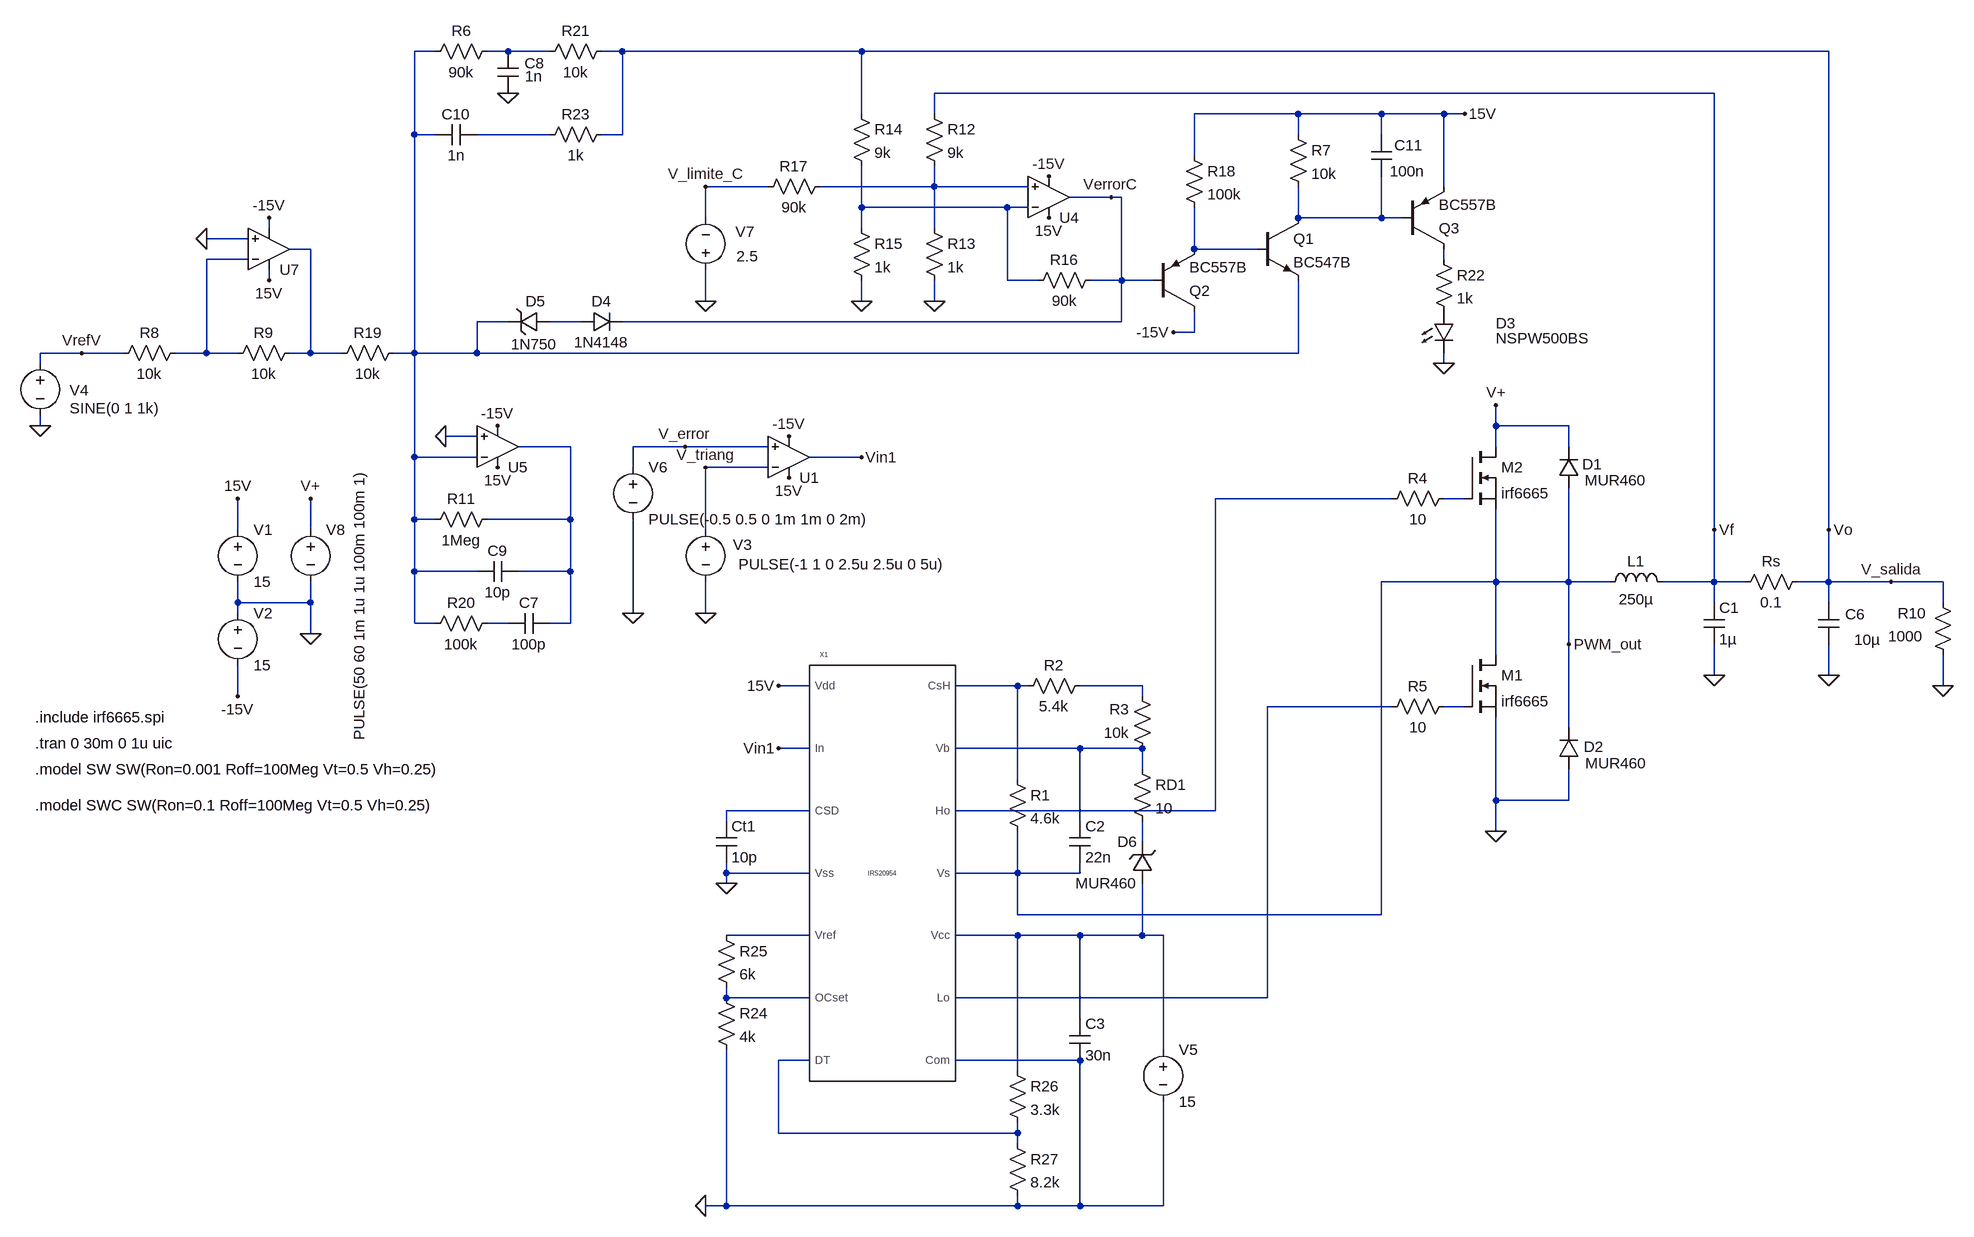
[diagram p0: schematic Fuente de alimentacion conmutada modo continuo topologia clase D(2).asc]
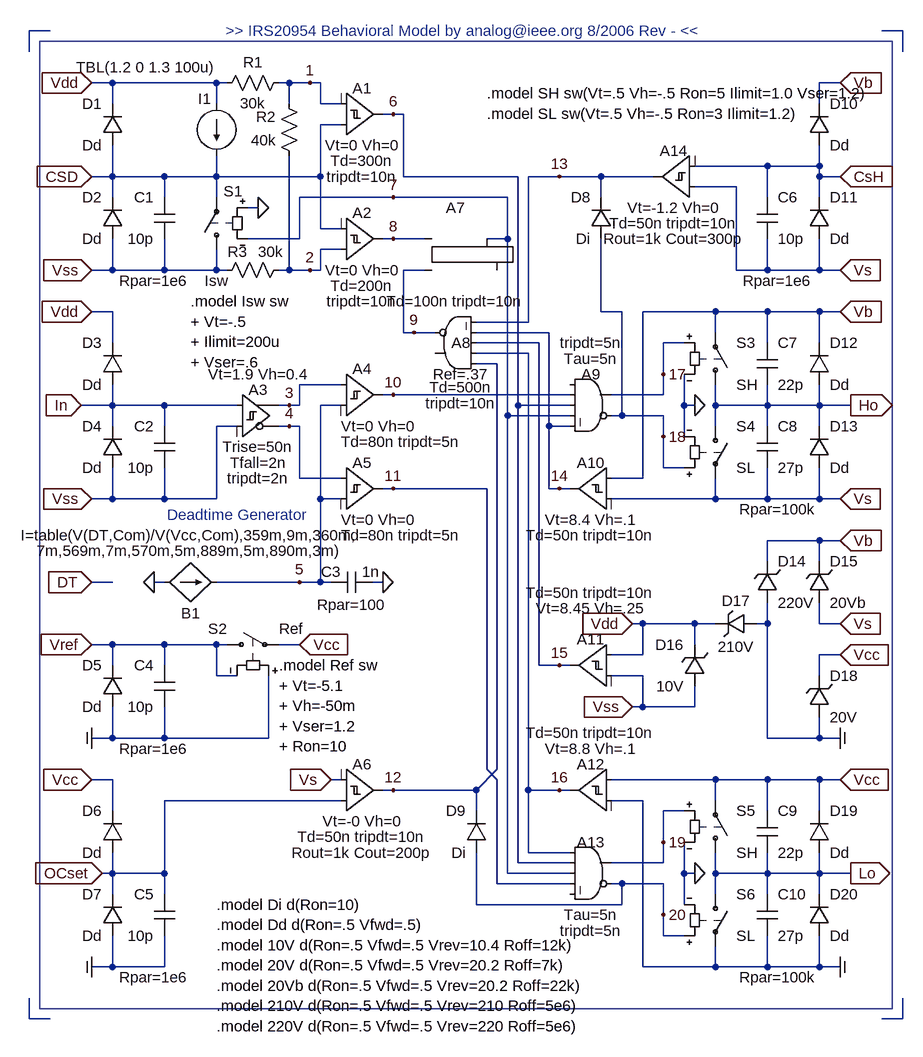
[diagram p1: sub-circuit irs20954.asc]
Fuente de alimentacion conmutada modo continuo topologia clase D(2).asc, the LTspice schematic file:
Version 4
SHEET 1 2792 680
WIRE -2544 -1872 -2576 -1872
WIRE -2432 -1872 -2464 -1872
WIRE -2368 -1872 -2432 -1872
WIRE -2256 -1872 -2288 -1872
WIRE -1888 -1872 -2256 -1872
WIRE -400 -1872 -1888 -1872
WIRE -576 -1808 -1776 -1808
WIRE -1888 -1776 -1888 -1872
WIRE -1776 -1776 -1776 -1808
WIRE -1216 -1776 -1376 -1776
WIRE -1088 -1776 -1216 -1776
WIRE -992 -1776 -1088 -1776
WIRE -960 -1776 -992 -1776
WIRE -2576 -1744 -2576 -1872
WIRE -2544 -1744 -2576 -1744
WIRE -2368 -1744 -2480 -1744
WIRE -2256 -1744 -2256 -1872
WIRE -2256 -1744 -2288 -1744
WIRE -1216 -1744 -1216 -1776
WIRE -1088 -1744 -1088 -1776
WIRE -1376 -1712 -1376 -1776
WIRE -2032 -1664 -2128 -1664
WIRE -1776 -1664 -1776 -1696
WIRE -1776 -1664 -1952 -1664
WIRE -1632 -1664 -1776 -1664
WIRE -992 -1664 -992 -1776
WIRE -1504 -1648 -1568 -1648
WIRE -1488 -1648 -1504 -1648
WIRE -1888 -1632 -1888 -1696
WIRE -1664 -1632 -1888 -1632
WIRE -1632 -1632 -1664 -1632
WIRE -2128 -1616 -2128 -1664
WIRE -1216 -1616 -1216 -1664
WIRE -1088 -1616 -1088 -1680
WIRE -1088 -1616 -1216 -1616
WIRE -1056 -1616 -1088 -1616
WIRE -2800 -1600 -2800 -1616
WIRE -1888 -1600 -1888 -1632
WIRE -1776 -1600 -1776 -1664
WIRE -2832 -1584 -2896 -1584
WIRE -2736 -1568 -2768 -1568
WIRE -1376 -1568 -1376 -1632
WIRE -1280 -1568 -1376 -1568
WIRE -2832 -1552 -2896 -1552
WIRE -992 -1552 -992 -1568
WIRE -2800 -1520 -2800 -1536
WIRE -1664 -1520 -1664 -1632
WIRE -1616 -1520 -1664 -1520
WIRE -1488 -1520 -1488 -1648
WIRE -1488 -1520 -1536 -1520
WIRE -1440 -1520 -1488 -1520
WIRE -2128 -1488 -2128 -1536
WIRE -1888 -1488 -1888 -1520
WIRE -1776 -1488 -1776 -1520
WIRE -2432 -1456 -2480 -1456
WIRE -2320 -1456 -2368 -1456
WIRE -1488 -1456 -1488 -1520
WIRE -1488 -1456 -2256 -1456
WIRE -1376 -1440 -1376 -1472
WIRE -1376 -1440 -1408 -1440
WIRE -3088 -1408 -3152 -1408
WIRE -3024 -1408 -3088 -1408
WIRE -2896 -1408 -2896 -1552
WIRE -2896 -1408 -2944 -1408
WIRE -2848 -1408 -2896 -1408
WIRE -2736 -1408 -2736 -1568
WIRE -2736 -1408 -2768 -1408
WIRE -2688 -1408 -2736 -1408
WIRE -2576 -1408 -2576 -1744
WIRE -2576 -1408 -2608 -1408
WIRE -2480 -1408 -2480 -1456
WIRE -2480 -1408 -2576 -1408
WIRE -1216 -1408 -1216 -1520
WIRE -1216 -1408 -2480 -1408
WIRE -3152 -1392 -3152 -1408
WIRE -992 -1392 -992 -1408
WIRE -3152 -1296 -3152 -1312
WIRE -912 -1296 -912 -1328
WIRE -800 -1296 -912 -1296
WIRE -2480 -1280 -2528 -1280
WIRE -2336 -1264 -2416 -1264
WIRE -2160 -1264 -2240 -1264
WIRE -2032 -1264 -2160 -1264
WIRE -912 -1264 -912 -1296
WIRE -800 -1264 -800 -1296
WIRE -2576 -1248 -2576 -1408
WIRE -2480 -1248 -2576 -1248
WIRE -1888 -1248 -1968 -1248
WIRE -2240 -1232 -2240 -1264
WIRE -2032 -1232 -2128 -1232
WIRE -1072 -1184 -1344 -1184
WIRE -960 -1184 -992 -1184
WIRE -2576 -1152 -2576 -1248
WIRE -2544 -1152 -2576 -1152
WIRE -2336 -1152 -2336 -1264
WIRE -2336 -1152 -2464 -1152
WIRE -2848 -1136 -2848 -1184
WIRE -2736 -1136 -2736 -1184
WIRE -2128 -1136 -2128 -1232
WIRE -576 -1136 -576 -1808
WIRE -400 -1136 -400 -1872
WIRE -2576 -1072 -2576 -1152
WIRE -2480 -1072 -2576 -1072
WIRE -2336 -1072 -2336 -1152
WIRE -2336 -1072 -2416 -1072
WIRE -912 -1056 -912 -1168
WIRE -912 -1056 -1088 -1056
WIRE -800 -1056 -800 -1200
WIRE -800 -1056 -912 -1056
WIRE -736 -1056 -800 -1056
WIRE -576 -1056 -576 -1136
WIRE -576 -1056 -656 -1056
WIRE -528 -1056 -576 -1056
WIRE -400 -1056 -400 -1136
WIRE -400 -1056 -448 -1056
WIRE -304 -1056 -400 -1056
WIRE -224 -1056 -304 -1056
WIRE -2848 -1024 -2848 -1056
WIRE -2736 -1024 -2736 -1056
WIRE -2736 -1024 -2848 -1024
WIRE -576 -1024 -576 -1056
WIRE -400 -1024 -400 -1056
WIRE -224 -1024 -224 -1056
WIRE -2848 -1008 -2848 -1024
WIRE -2240 -1008 -2240 -1152
WIRE -2128 -1008 -2128 -1056
WIRE -2576 -992 -2576 -1072
WIRE -2544 -992 -2576 -992
WIRE -2432 -992 -2464 -992
WIRE -2336 -992 -2336 -1072
WIRE -2336 -992 -2368 -992
WIRE -2736 -976 -2736 -1024
WIRE -800 -960 -800 -1056
WIRE -912 -944 -912 -1056
WIRE -576 -912 -576 -960
WIRE -400 -912 -400 -960
WIRE -1968 -896 -2016 -896
WIRE -1648 -896 -1744 -896
WIRE -1632 -896 -1648 -896
WIRE -1456 -896 -1552 -896
WIRE -224 -896 -224 -944
WIRE -2848 -880 -2848 -928
WIRE -1456 -880 -1456 -896
WIRE -1072 -864 -1264 -864
WIRE -960 -864 -992 -864
WIRE -800 -832 -800 -960
WIRE -1968 -800 -2016 -800
WIRE -1552 -800 -1744 -800
WIRE -1456 -800 -1552 -800
WIRE -1456 -768 -1456 -800
WIRE -1648 -752 -1648 -896
WIRE -912 -720 -912 -848
WIRE -800 -720 -800 -768
WIRE -800 -720 -912 -720
WIRE -1968 -704 -2096 -704
WIRE -1344 -704 -1344 -1184
WIRE -1344 -704 -1744 -704
WIRE -2096 -688 -2096 -704
WIRE -1552 -688 -1552 -800
WIRE -912 -672 -912 -720
WIRE -1456 -656 -1456 -688
WIRE -2096 -608 -2096 -624
WIRE -1968 -608 -2096 -608
WIRE -1648 -608 -1648 -672
WIRE -1648 -608 -1744 -608
WIRE -1552 -608 -1552 -624
WIRE -1552 -608 -1648 -608
WIRE -2096 -592 -2096 -608
WIRE -1648 -544 -1648 -608
WIRE -1088 -544 -1088 -1056
WIRE -1088 -544 -1648 -544
WIRE -1968 -512 -2096 -512
WIRE -1648 -512 -1744 -512
WIRE -1552 -512 -1648 -512
WIRE -1456 -512 -1456 -592
WIRE -1456 -512 -1552 -512
WIRE -1424 -512 -1456 -512
WIRE -2096 -416 -2096 -432
WIRE -1968 -416 -2096 -416
WIRE -1264 -416 -1264 -864
WIRE -1264 -416 -1744 -416
WIRE -1552 -384 -1552 -512
WIRE -1424 -336 -1424 -512
WIRE -1968 -320 -2016 -320
WIRE -1552 -320 -1744 -320
WIRE -1648 -304 -1648 -512
WIRE -2016 -208 -2016 -320
WIRE -1648 -208 -1648 -224
WIRE -1648 -208 -2016 -208
WIRE -1648 -192 -1648 -208
WIRE -2096 -96 -2096 -336
WIRE -2096 -96 -2128 -96
WIRE -1648 -96 -1648 -112
WIRE -1648 -96 -2096 -96
WIRE -1552 -96 -1552 -320
WIRE -1552 -96 -1648 -96
WIRE -1424 -96 -1424 -256
WIRE -1424 -96 -1552 -96
FLAG -2848 -1184 15V
FLAG -2736 -976 0
FLAG -2848 -880 -15V
FLAG -912 -1328 V+
FLAG -576 -912 0
FLAG -2128 -1008 0
FLAG -3152 -1296 0
FLAG -912 -672 0
FLAG -2000 -1216 15V
FLAG -2000 -1280 -15V
FLAG -400 -1136 Vo
FLAG -576 -1136 Vf
FLAG -3088 -1408 VrefV
FLAG -2736 -1184 V+
FLAG -304 -1056 V_salida
FLAG -1776 -1488 0
FLAG -1888 -1488 0
FLAG -1504 -1648 VerrorC
FLAG -1600 -1616 15V
FLAG -1600 -1680 -15V
FLAG -2448 -1232 15V
FLAG -2448 -1296 -15V
FLAG -2800 -1520 15V
FLAG -2800 -1616 -15V
FLAG -2896 -1584 0
FLAG -2528 -1280 0
FLAG -400 -912 0
FLAG -2128 -1232 V_triang
FLAG -2160 -1264 V_error
FLAG -2432 -1808 0
FLAG -2128 -1488 0
FLAG -2128 -1664 V_limite_C
FLAG -960 -1776 15V
FLAG -1408 -1440 -15V
FLAG -992 -1392 0
FLAG -800 -960 PWM_out
FLAG -2128 -96 0
FLAG -2016 -896 15V
FLAG -2016 -800 Vin1
FLAG -2096 -592 0
FLAG -1888 -1248 Vin1
FLAG -224 -896 0
FLAG -2240 -1008 0
SYMBOL voltage -2848 -1152 R0
SYMATTR InstName V1
SYMATTR Value 15
SYMBOL voltage -2848 -1024 R0
SYMATTR InstName V2
SYMATTR Value 15
SYMBOL nmos -960 -944 R0
SYMATTR InstName M1
SYMATTR Value irf6665
SYMATTR Prefix X
SYMBOL nmos -960 -1264 R0
SYMATTR InstName M2
SYMATTR Value irf6665
SYMATTR Prefix X
SYMBOL ind -752 -1040 R270
WINDOW 0 32 56 VTop 2
WINDOW 3 5 56 VBottom 2
SYMATTR InstName L1
SYMATTR Value 250µ
SYMBOL cap -592 -1024 R0
SYMATTR InstName C1
SYMATTR Value 1µ
SYMBOL Opamps\\UniversalOpamp2 -2000 -1248 M180
SYMATTR InstName U1
SYMATTR Value2 Avol=1Meg GBW=100000Meg Slew=100000Meg
SYMBOL voltage -3152 -1408 R0
WINDOW 3 45 85 Left 2
WINDOW 123 0 0 Left 2
WINDOW 39 0 0 Left 2
WINDOW 0 45 57 Left 2
SYMATTR Value SINE(0 1 1k)
SYMATTR InstName V4
SYMBOL res -976 -1200 R90
WINDOW 0 0 56 VBottom 2
WINDOW 3 32 56 VTop 2
SYMATTR InstName R4
SYMATTR Value 10
SYMBOL res -976 -880 R90
WINDOW 0 0 56 VBottom 2
WINDOW 3 32 56 VTop 2
SYMATTR InstName R5
SYMATTR Value 10
SYMBOL res -432 -1072 R90
WINDOW 0 0 56 VBottom 2
WINDOW 3 32 56 VTop 2
SYMATTR InstName Rs
SYMATTR Value 0.1
SYMBOL voltage -2736 -1152 R0
WINDOW 123 0 0 Left 2
WINDOW 39 0 0 Left 2
WINDOW 3 75 -79 VRight 2
SYMATTR Value PULSE(50 60 1m 1u 1u 100m 100m 1)
SYMATTR InstName V8
SYMBOL res -240 -1040 R0
WINDOW 0 -54 32 Left 2
WINDOW 3 -68 68 Left 2
SYMATTR InstName R10
SYMATTR Value 1000
SYMBOL diode -784 -1200 R180
WINDOW 0 -36 37 Left 2
WINDOW 3 -104 12 Left 2
SYMATTR InstName D1
SYMATTR Value MUR460
SYMBOL diode -784 -768 R180
WINDOW 0 -38 34 Left 2
WINDOW 3 -105 9 Left 2
SYMATTR InstName D2
SYMATTR Value MUR460
SYMBOL Opamps\\UniversalOpamp2 -1600 -1648 M180
SYMATTR InstName U4
SYMATTR Value2 Avol=1Meg GBW=100000Meg Slew=100000Meg
SYMBOL res -1792 -1792 R0
SYMATTR InstName R12
SYMATTR Value 9k
SYMBOL res -1792 -1616 R0
SYMATTR InstName R13
SYMATTR Value 1k
SYMBOL res -1904 -1792 R0
SYMATTR InstName R14
SYMATTR Value 9k
SYMBOL res -1904 -1616 R0
SYMATTR InstName R15
SYMATTR Value 1k
SYMBOL res -1520 -1536 R90
WINDOW 0 0 56 VBottom 2
WINDOW 3 32 56 VTop 2
SYMATTR InstName R16
SYMATTR Value 90k
SYMBOL res -1936 -1680 R90
WINDOW 0 0 56 VBottom 2
WINDOW 3 32 56 VTop 2
SYMATTR InstName R17
SYMATTR Value 90k
SYMBOL Opamps\\UniversalOpamp2 -2448 -1264 M180
SYMATTR InstName U5
SYMATTR Value2 Avol=1Meg GBW=100000Meg Slew=100000Meg
SYMBOL Opamps\\UniversalOpamp2 -2800 -1568 M180
SYMATTR InstName U7
SYMATTR Value2 Avol=1Meg GBW=100000Meg Slew=100000Meg
SYMBOL res -2928 -1424 R90
WINDOW 0 0 56 VBottom 2
WINDOW 3 32 56 VTop 2
SYMATTR InstName R8
SYMATTR Value 10k
SYMBOL res -2752 -1424 R90
WINDOW 0 0 56 VBottom 2
WINDOW 3 32 56 VTop 2
SYMATTR InstName R9
SYMATTR Value 10k
SYMBOL res -2448 -1168 R90
WINDOW 0 0 56 VBottom 2
WINDOW 3 32 56 VTop 2
SYMATTR InstName R11
SYMATTR Value 1Meg
SYMBOL res -2592 -1424 R90
WINDOW 0 0 56 VBottom 2
WINDOW 3 32 56 VTop 2
SYMATTR InstName R19
SYMATTR Value 10k
SYMBOL cap -384 -960 R180
WINDOW 0 -40 46 Left 2
WINDOW 3 -64 7 Left 2
SYMATTR InstName C6
SYMATTR Value 10µ
SYMBOL cap -2416 -1088 R90
WINDOW 0 0 32 VBottom 2
WINDOW 3 32 32 VTop 2
SYMATTR InstName C9
SYMATTR Value 10p
SYMBOL voltage -2128 -1152 R0
WINDOW 123 0 0 Left 2
WINDOW 39 0 0 Left 2
WINDOW 3 369 69 Right 2
WINDOW 0 42 39 Left 2
SYMATTR Value PULSE(-1 1 0 2.5u 2.5u 0 5u)
SYMATTR InstName V3
SYMBOL res -2448 -1888 R90
WINDOW 0 0 56 VBottom 2
WINDOW 3 32 56 VTop 2
SYMATTR InstName R6
SYMATTR Value 90k
SYMBOL cap -2368 -1008 R90
WINDOW 0 0 32 VBottom 2
WINDOW 3 32 32 VTop 2
SYMATTR InstName C7
SYMATTR Value 100p
SYMBOL res -2448 -1008 R90
WINDOW 0 0 56 VBottom 2
WINDOW 3 32 56 VTop 2
SYMATTR InstName R20
SYMATTR Value 100k
SYMBOL res -2272 -1888 R90
WINDOW 0 0 56 VBottom 2
WINDOW 3 32 56 VTop 2
SYMATTR InstName R21
SYMATTR Value 10k
SYMBOL cap -2416 -1808 R180
WINDOW 0 -40 46 Left 2
WINDOW 3 -37 26 Left 2
SYMATTR InstName C8
SYMATTR Value 1n
SYMBOL cap -2480 -1760 R90
WINDOW 0 0 32 VBottom 2
WINDOW 3 32 32 VTop 2
SYMATTR InstName C10
SYMATTR Value 1n
SYMBOL res -2272 -1760 R90
WINDOW 0 0 56 VBottom 2
WINDOW 3 32 56 VTop 2
SYMATTR InstName R23
SYMATTR Value 1k
SYMBOL voltage -2128 -1520 R180
WINDOW 0 -75 75 Left 2
WINDOW 3 -81 37 Left 2
WINDOW 123 0 0 Left 0
WINDOW 39 0 0 Left 0
SYMATTR InstName V7
SYMATTR Value 2.5
SYMBOL npn -1280 -1616 R0
SYMATTR InstName Q1
SYMATTR Value BC547B
SYMBOL pnp -1440 -1472 M180
SYMATTR InstName Q2
SYMATTR Value BC557B
SYMBOL res -1392 -1728 R0
SYMATTR InstName R18
SYMATTR Value 100k
SYMBOL LED -1008 -1472 R0
WINDOW 0 96 18 Left 2
WINDOW 3 96 41 Left 2
SYMATTR InstName D3
SYMATTR Value NSPW500BS
SYMBOL res -1232 -1760 R0
SYMATTR InstName R7
SYMATTR Value 10k
SYMBOL pnp -1056 -1568 M180
SYMATTR InstName Q3
SYMATTR Value BC557B
SYMBOL res -1008 -1568 R0
SYMATTR InstName R22
SYMATTR Value 1k
SYMBOL cap -1072 -1680 R180
WINDOW 0 -48 48 Left 2
WINDOW 3 -51 8 Left 2
SYMATTR InstName C11
SYMATTR Value 100n
SYMBOL diode -2320 -1440 R270
WINDOW 0 32 32 VTop 2
WINDOW 3 0 32 VBottom 2
SYMATTR InstName D4
SYMATTR Value 1N4148
SYMBOL zener -2368 -1472 R90
WINDOW 0 0 22 VBottom 2
WINDOW 3 35 24 VTop 2
SYMATTR InstName D5
SYMATTR Value 1N750
SYMATTR Description Diode
SYMATTR Type diode
SYMBOL IRS20954 -1856 -608 R0
SYMATTR InstName X1
SYMBOL cap -1568 -688 R0
SYMATTR InstName C2
SYMATTR Value 22n
SYMBOL cap -2112 -688 R0
SYMATTR InstName Ct1
SYMATTR Value 10p
SYMBOL cap -1568 -384 R0
SYMATTR InstName C3
SYMATTR Value 30n
SYMBOL zener -1440 -592 R180
WINDOW 0 24 64 Left 2
WINDOW 3 24 0 Left 2
SYMATTR InstName D6
SYMATTR Value MUR460
SYMBOL voltage -1424 -352 R0
SYMATTR InstName V5
SYMATTR Value 15
SYMBOL res -1472 -784 R0
SYMATTR InstName RD1
SYMATTR Value 10
SYMBOL res -1664 -768 R0
SYMATTR InstName R1
SYMATTR Value 4.6k
SYMBOL res -1536 -912 R90
WINDOW 0 0 56 VBottom 2
WINDOW 3 32 56 VTop 2
SYMATTR InstName R2
SYMATTR Value 5.4k
SYMBOL res -1440 -784 R180
WINDOW 0 36 76 Left 2
WINDOW 3 36 40 Left 2
SYMATTR InstName R3
SYMATTR Value 10k
SYMBOL res -2112 -432 R0
SYMATTR InstName R24
SYMATTR Value 4k
SYMBOL res -2112 -528 R0
SYMATTR InstName R25
SYMATTR Value 6k
SYMBOL res -1664 -320 R0
SYMATTR InstName R26
SYMATTR Value 3.3k
SYMBOL res -1664 -208 R0
SYMATTR InstName R27
SYMATTR Value 8.2k
SYMBOL voltage -2240 -1248 R0
WINDOW 123 0 0 Left 0
WINDOW 39 0 0 Left 0
SYMATTR InstName V6
SYMATTR Value PULSE(-0.5 0.5 0 1m 1m 0 2m)
TEXT -3160 -768 Left 2 !.model SW SW(Ron=0.001 Roff=100Meg Vt=0.5 Vh=0.25)
TEXT -3160 -808 Left 2 !.tran 0 30m 0 1u uic
TEXT -3160 -848 Left 2 !.include irf6665.spi
TEXT -3160 -712 Left 2 !.model SWC SW(Ron=0.1 Roff=100Meg Vt=0.5 Vh=0.25)

irs20954.asc, the sub-circuit schematic file:
Version 4
SHEET 1 13828 1048
WIRE -480 -576 -512 -576
WIRE 832 -576 800 -576
WIRE -512 -544 -512 -576
WIRE 832 -544 832 -576
WIRE -384 -496 -416 -496
WIRE -224 -496 -384 -496
WIRE -208 -496 -224 -496
WIRE -112 -496 -128 -496
WIRE -80 -496 -112 -496
WIRE -64 -496 -80 -496
WIRE 736 -496 704 -496
WIRE -384 -464 -384 -496
WIRE -224 -464 -224 -496
WIRE -112 -464 -112 -496
WIRE -64 -464 -64 -496
WIRE -32 -464 -64 -464
WIRE 704 -464 704 -496
WIRE 48 -448 32 -448
WIRE 64 -448 48 -448
WIRE -32 -432 -64 -432
WIRE 624 -368 512 -368
WIRE 704 -368 704 -400
WIRE 704 -368 624 -368
WIRE -384 -352 -384 -400
WIRE -384 -352 -416 -352
WIRE -304 -352 -384 -352
WIRE -224 -352 -224 -384
WIRE -224 -352 -304 -352
WIRE -64 -352 -64 -432
WIRE -64 -352 -224 -352
WIRE 64 -352 64 -448
WIRE 240 -352 64 -352
WIRE 304 -352 256 -352
WIRE 368 -352 304 -352
WIRE 448 -352 368 -352
WIRE 704 -352 704 -368
WIRE 736 -352 704 -352
WIRE 576 -336 512 -336
WIRE -384 -320 -384 -352
WIRE -304 -320 -304 -352
WIRE -224 -320 -224 -352
WIRE 48 -320 -96 -320
WIRE 224 -320 48 -320
WIRE 368 -320 368 -352
WIRE 624 -320 624 -368
WIRE 704 -320 704 -352
WIRE -160 -304 -176 -304
WIRE -64 -272 -64 -352
WIRE -32 -272 -64 -272
WIRE -96 -256 -96 -320
WIRE -96 -256 -176 -256
WIRE 48 -256 32 -256
WIRE 96 -256 48 -256
WIRE 224 -256 224 -320
WIRE 224 -256 192 -256
WIRE -32 -240 -64 -240
WIRE -384 -208 -384 -256
WIRE -384 -208 -416 -208
WIRE -304 -208 -304 -256
WIRE -304 -208 -384 -208
WIRE -224 -208 -224 -240
WIRE -224 -208 -304 -208
WIRE -208 -208 -224 -208
WIRE -112 -208 -112 -384
WIRE -112 -208 -128 -208
WIRE -80 -208 -112 -208
WIRE -64 -208 -64 -240
WIRE -64 -208 -80 -208
WIRE 96 -208 64 -208
WIRE 576 -208 576 -336
WIRE 624 -208 624 -256
WIRE 624 -208 576 -208
WIRE 704 -208 704 -256
WIRE 704 -208 624 -208
WIRE 736 -208 704 -208
WIRE -384 -144 -416 -144
WIRE 368 -144 368 -256
WIRE 400 -144 368 -144
WIRE 544 -144 432 -144
WIRE 624 -144 544 -144
WIRE 704 -144 624 -144
WIRE 736 -144 704 -144
WIRE 256 -128 256 -352
WIRE 256 -128 176 -128
WIRE 64 -112 64 -208
WIRE 80 -112 64 -112
WIRE 112 -112 80 -112
WIRE 288 -112 176 -112
WIRE 544 -112 544 -144
WIRE -384 -96 -384 -144
WIRE 272 -96 176 -96
WIRE 496 -96 464 -96
WIRE 624 -96 624 -144
WIRE 704 -96 704 -144
WIRE 256 -80 176 -80
WIRE 208 -64 176 -64
WIRE 464 -48 464 -96
WIRE -32 -32 -96 -32
WIRE 48 -16 32 -16
WIRE 320 -16 48 -16
WIRE 464 -16 464 -48
WIRE 464 -16 384 -16
WIRE -384 0 -384 -32
WIRE -384 0 -432 0
WIRE -304 0 -384 0
WIRE -192 0 -304 0
WIRE -112 0 -128 0
WIRE -96 0 -96 -32
WIRE -96 0 -112 0
WIRE -32 0 -64 0
WIRE 240 0 240 -352
WIRE 320 0 240 0
WIRE 496 0 496 -48
WIRE 512 0 496 0
WIRE 544 0 544 -32
WIRE 624 0 624 -32
WIRE 624 0 544 0
WIRE 704 0 704 -32
WIRE 704 0 624 0
WIRE 752 0 704 0
WIRE 224 16 224 -256
WIRE 320 16 224 16
WIRE 400 16 400 -144
WIRE 400 16 384 16
WIRE 464 16 400 16
WIRE -384 32 -384 0
WIRE -304 32 -304 0
WIRE -192 32 -224 32
WIRE -112 32 -128 32
WIRE -96 32 -112 32
WIRE 288 32 288 -112
WIRE 320 32 288 32
WIRE 544 32 544 0
WIRE 624 32 624 0
WIRE 704 32 704 0
WIRE 464 48 464 16
WIRE 496 48 496 0
WIRE 464 96 464 48
WIRE 496 96 464 96
WIRE -96 112 -96 32
WIRE -32 112 -96 112
WIRE 432 112 432 -144
WIRE 432 112 384 112
WIRE 48 128 32 128
WIRE 192 128 48 128
WIRE 288 128 288 32
WIRE 304 128 288 128
WIRE 320 128 304 128
WIRE -384 144 -384 96
WIRE -384 144 -416 144
WIRE -304 144 -304 96
WIRE -304 144 -384 144
WIRE -224 144 -224 32
WIRE -224 144 -304 144
WIRE -64 144 -64 0
WIRE -32 144 -64 144
WIRE 544 144 544 112
WIRE 544 144 384 144
WIRE 624 144 624 96
WIRE 624 144 544 144
WIRE 704 144 704 96
WIRE 704 144 624 144
WIRE 736 144 704 144
WIRE 704 208 624 208
WIRE 736 208 704 208
WIRE 624 240 624 208
WIRE 704 240 704 208
WIRE -384 272 -416 272
WIRE -304 272 -320 272
WIRE -96 272 -224 272
WIRE -64 272 -64 144
WIRE -64 272 -96 272
WIRE -48 272 -64 272
WIRE 32 272 16 272
WIRE 432 336 416 336
WIRE 512 336 432 336
WIRE 544 336 512 336
WIRE 624 336 624 304
WIRE 624 336 608 336
WIRE 704 336 704 304
WIRE 736 336 704 336
WIRE -384 368 -416 368
WIRE -304 368 -384 368
WIRE -224 368 -304 368
WIRE -208 368 -224 368
WIRE -96 368 -128 368
WIRE 512 368 512 336
WIRE 432 384 432 336
WIRE 432 384 384 384
WIRE 736 384 704 384
WIRE -384 400 -384 368
WIRE -304 400 -304 368
WIRE 272 400 272 -96
WIRE 304 400 272 400
WIRE 320 400 304 400
WIRE -224 416 -224 368
WIRE -192 416 -224 416
WIRE 432 416 384 416
WIRE 704 416 704 384
WIRE 432 464 432 416
WIRE 432 464 416 464
WIRE 512 464 512 432
WIRE 512 464 432 464
WIRE -384 512 -384 464
WIRE -384 512 -416 512
WIRE -304 512 -304 464
WIRE -304 512 -384 512
WIRE -144 512 -144 416
WIRE -144 512 -304 512
WIRE 624 512 624 336
WIRE 704 512 704 480
WIRE 704 512 624 512
WIRE 736 512 704 512
WIRE 192 560 192 128
WIRE 208 560 208 -64
WIRE -384 576 -416 576
WIRE -32 576 -48 576
WIRE 208 576 192 560
WIRE 544 576 384 576
WIRE 624 576 544 576
WIRE 704 576 624 576
WIRE 736 576 704 576
WIRE 48 592 32 592
WIRE 176 592 208 560
WIRE 176 592 48 592
WIRE 256 592 256 -80
WIRE 304 592 256 592
WIRE 320 592 304 592
WIRE -32 608 -304 608
WIRE 432 608 384 608
WIRE 544 608 544 576
WIRE -384 624 -384 576
WIRE 176 624 176 592
WIRE 496 624 464 624
WIRE 624 624 624 576
WIRE 704 624 704 576
WIRE 464 672 464 624
WIRE 256 688 256 592
WIRE 320 688 256 688
WIRE 240 704 240 0
WIRE 320 704 240 704
WIRE 464 704 464 672
WIRE 464 704 384 704
WIRE -384 720 -384 688
WIRE -384 720 -400 720
WIRE -304 720 -304 608
WIRE -304 720 -384 720
WIRE 224 720 224 16
WIRE 320 720 224 720
WIRE 496 720 496 672
WIRE 512 720 496 720
WIRE 544 720 544 688
WIRE 624 720 624 688
WIRE 624 720 544 720
WIRE 704 720 704 688
WIRE 704 720 624 720
WIRE 752 720 704 720
WIRE 208 736 208 576
WIRE 320 736 208 736
WIRE 400 736 384 736
WIRE 464 736 400 736
WIRE -384 752 -384 720
WIRE -304 752 -304 720
WIRE 544 752 544 720
WIRE 624 752 624 720
WIRE 704 752 704 720
WIRE 176 768 176 688
WIRE 400 768 400 736
WIRE 400 768 176 768
WIRE 496 768 496 720
WIRE 464 784 464 736
WIRE 464 816 464 784
WIRE 496 816 464 816
WIRE -384 864 -384 816
WIRE -384 864 -416 864
WIRE -304 864 -304 816
WIRE -304 864 -384 864
WIRE 432 864 432 608
WIRE 544 864 544 832
WIRE 544 864 432 864
WIRE 624 864 624 816
WIRE 624 864 544 864
WIRE 704 864 704 816
WIRE 704 864 624 864
WIRE 736 864 704 864
WIRE -512 944 -512 912
WIRE -480 944 -512 944
WIRE 832 944 832 912
WIRE 832 944 800 944
FLAG 752 0 Ho
IOPIN 752 0 Out
FLAG -432 0 In
IOPIN -432 0 In
FLAG -416 -144 Vdd
IOPIN -416 -144 In
FLAG 736 -144 Vb
IOPIN 736 -144 In
FLAG 736 144 Vs
IOPIN 736 144 In
FLAG -416 144 Vss
IOPIN -416 144 In
FLAG 736 512 Com
IOPIN 736 512 In
FLAG 736 576 Vcc
IOPIN 736 576 In
FLAG 736 864 Com
IOPIN 736 864 In
FLAG 752 720 Lo
IOPIN 752 720 Out
FLAG -96 272 5
FLAG 512 720 0
FLAG 512 0 0
FLAG 80 -112 9
FLAG 464 -48 17
FLAG 464 48 18
FLAG 736 384 Vcc
IOPIN 736 384 In
FLAG 736 208 Vb
IOPIN 736 208 In
FLAG 736 336 Vs
IOPIN 736 336 In
FLAG -112 0 3
FLAG 304 -352 13
FLAG 304 128 14
FLAG -112 32 4
FLAG 48 -16 10
FLAG -400 720 OCset
IOPIN -400 720 In
FLAG 32 272 0
FLAG -320 272 0
FLAG -416 272 DT
IOPIN -416 272 In
FLAG 464 672 19
FLAG 464 784 20
FLAG 416 464 Vss
IOPIN 416 464 In
FLAG 416 336 Vdd
IOPIN 416 336 In
FLAG 736 -352 CsH
IOPIN 736 -352 In
FLAG 736 -496 Vb
IOPIN 736 -496 In
FLAG 736 -208 Vs
IOPIN 736 -208 In
FLAG -416 -352 CSD
IOPIN -416 -352 In
FLAG -416 -496 Vdd
IOPIN -416 -496 In
FLAG -416 -208 Vss
IOPIN -416 -208 In
FLAG -160 -304 0
FLAG -416 368 Vref
IOPIN -416 368 In
FLAG -48 576 Vs
IOPIN -48 576 In
FLAG -416 576 Vcc
IOPIN -416 576 In
FLAG -416 864 Com
IOPIN -416 864 In
FLAG -80 -496 1
FLAG -80 -208 2
FLAG 48 128 11
FLAG 48 -448 6
FLAG 48 -320 7
FLAG 48 -256 8
FLAG 48 592 12
FLAG 304 400 15
FLAG 304 592 16
FLAG -96 368 Vcc
IOPIN -96 368 In
FLAG -416 512 Com
IOPIN -416 512 In
SYMBOL diode -368 -400 R180
WINDOW 0 32 64 Left 0
WINDOW 3 32 0 Left 0
SYMATTR InstName D1
SYMATTR Value Dd
SYMBOL diode -368 -256 R180
WINDOW 0 32 64 Left 0
WINDOW 3 32 0 Left 0
SYMATTR InstName D2
SYMATTR Value Dd
SYMBOL cap -288 -320 M0
WINDOW 0 32 0 Left 0
WINDOW 3 32 64 Left 0
WINDOW 39 32 128 Center 0
SYMATTR InstName C1
SYMATTR Value 10p
SYMATTR SpiceLine Rpar=1e6
SYMBOL current -224 -464 R0
WINDOW 123 0 0 Left 0
WINDOW 39 0 0 Left 0
WINDOW 3 0 -56 Right 0
WINDOW 0 -8 -8 Right 0
SYMATTR Value TBL(1.2 0 1.3 100u)
SYMATTR InstName I1
SYMBOL sw -224 -224 R180
WINDOW 0 -11 105 Right 0
WINDOW 3 0 -32 Center 0
SYMATTR InstName S1
SYMATTR Value Isw
SYMBOL res -224 -480 R270
WINDOW 0 32 56 VTop 0
WINDOW 3 0 56 VBottom 0
SYMATTR InstName R1
SYMATTR Value 30k
SYMBOL res -96 -368 R180
WINDOW 0 36 76 Left 0
WINDOW 3 36 40 Left 0
SYMATTR InstName R2
SYMATTR Value 40k
SYMBOL res -112 -224 R90
WINDOW 0 -12 64 VRight 0
WINDOW 3 -12 48 VLeft 0
SYMATTR InstName R3
SYMATTR Value 30k
SYMBOL Digital\\diffschmtbuf -32 -384 M180
WINDOW 0 32 104 Center 0
WINDOW 3 32 16 Center 0
WINDOW 123 32 -8 Center 0
WINDOW 39 32 -32 Center 0
SYMATTR InstName A1
SYMATTR Value Vt=0 Vh=0
SYMATTR Value2 Td=300n
SYMATTR SpiceLine tripdt=10n
SYMBOL Digital\\diffschmtbuf -32 -192 M180
WINDOW 0 32 104 Center 0
WINDOW 3 32 16 Center 0
WINDOW 123 32 -8 Center 0
WINDOW 39 32 -32 Center 0
SYMATTR InstName A2
SYMATTR Value Vt=0 Vh=0
SYMATTR Value2 Td=200n
SYMATTR SpiceLine tripdt=10n
SYMBOL diode -368 -32 R180
WINDOW 0 32 64 Left 0
WINDOW 3 32 0 Left 0
SYMATTR InstName D3
SYMATTR Value Dd
SYMBOL diode -368 96 R180
WINDOW 0 32 64 Left 0
WINDOW 3 32 0 Left 0
SYMATTR InstName D4
SYMATTR Value Dd
SYMBOL cap -288 32 M0
WINDOW 0 32 0 Left 0
WINDOW 3 32 64 Left 0
SYMATTR InstName C2
SYMATTR Value 10p
SYMBOL Digital\\diffschmitt -192 -48 R0
WINDOW 0 32 24 Center 0
WINDOW 3 32 0 Center 0
WINDOW 123 32 112 Center 0
WINDOW 39 32 136 Center 0
WINDOW 40 32 160 Center 0
SYMATTR InstName A3
SYMATTR Value Vt=1.9 Vh=0.4
SYMATTR Value2 Trise=50n
SYMATTR SpiceLine Tfall=2n
SYMATTR SpiceLine2 tripdt=2n
SYMBOL Digital\\diffschmtbuf -32 -80 R0
WINDOW 0 32 24 Center 0
WINDOW 3 0 112 Left 0
WINDOW 123 0 136 Left 0
SYMATTR InstName A4
SYMATTR Value Vt=0 Vh=0
SYMATTR Value2 Td=80n tripdt=5n
SYMBOL Digital\\diffschmtbuf -32 64 R0
WINDOW 0 32 24 Center 0
WINDOW 3 0 112 Left 0
WINDOW 123 0 136 Left 0
SYMATTR InstName A5
SYMATTR Value Vt=0 Vh=0
SYMATTR Value2 Td=80n tripdt=5n
SYMBOL bi -304 272 R270
WINDOW 0 -48 40 VCenter 0
WINDOW 3 72 40 VCenter 0
WINDOW 123 48 40 VCenter 0
SYMATTR InstName B1
SYMATTR Value I=table(V(DT,Com)/V(Vcc,Com),359m,9m,360m,
SYMATTR Value2 7m,569m,7m,570m,5m,889m,5m,890m,3m)
SYMBOL cap -48 256 M90
WINDOW 0 0 16 VLeft 0
WINDOW 3 0 48 VRight 0
WINDOW 39 35 32 VTop 0
SYMATTR InstName C3
SYMATTR Value 1n
SYMATTR SpiceLine Rpar=100
SYMBOL sw -224 368 R270
WINDOW 0 24 16 VLeft 0
WINDOW 3 24 96 VRight 0
SYMATTR InstName S2
SYMATTR Value Ref
SYMBOL Digital\\diffschmtbuf -32 656 M180
WINDOW 0 32 104 Center 0
WINDOW 3 32 16 Center 0
WINDOW 123 32 -8 Center 0
WINDOW 39 32 -32 Center 0
SYMATTR InstName A6
SYMATTR Value Vt=-0 Vh=0
SYMATTR Value2 Td=50n tripdt=10n
SYMATTR SpiceLine Rout=1k Cout=200p
SYMBOL Digital\\srflop 144 -304 R0
WINDOW 0 0 0 Center 0
WINDOW 3 0 144 Center 0
SYMATTR InstName A7
SYMATTR Value Td=100n tripdt=10n
SYMBOL Digital\\and 144 -32 R180
WINDOW 0 -8 64 Center 0
WINDOW 3 -8 16 Center 0
WINDOW 123 -8 -4 Center 0
WINDOW 39 -8 -29 Center 0
SYMATTR InstName A8
SYMATTR Value Ref=.37
SYMATTR Value2 Td=500n
SYMATTR SpiceLine tripdt=10n
SYMBOL Digital\\and 352 -64 R0
WINDOW 0 0 16 Center 0
WINDOW 3 0 -8 Center 0
WINDOW 123 0 -32 Center 0
SYMATTR InstName A9
SYMATTR Value Tau=5n
SYMATTR Value2 tripdt=5n
SYMBOL Digital\\diffschmtbuf 384 64 M0
WINDOW 0 32 24 Center 0
WINDOW 3 32 112 Center 0
WINDOW 123 32 136 Center 0
SYMATTR InstName A10
SYMATTR Value Vt=8.4 Vh=.1
SYMATTR Value2 Td=50n tripdt=10n
SYMBOL Digital\\diffschmtbuf 384 336 M0
WINDOW 0 32 24 Center 0
WINDOW 3 32 -24 Center 0
WINDOW 123 32 -48 Center 0
SYMATTR InstName A11
SYMATTR Value Vt=8.45 Vh=.25
SYMATTR Value2 Td=50n tripdt=10n
SYMBOL Digital\\diffschmtbuf 384 528 M0
WINDOW 0 32 24 Center 0
WINDOW 3 32 0 Center 0
WINDOW 123 32 -24 Center 0
SYMATTR InstName A12
SYMATTR Value Vt=8.8 Vh=.1
SYMATTR Value2 Td=50n tripdt=10n
SYMBOL Digital\\and 352 656 R0
WINDOW 0 0 16 Center 0
WINDOW 3 0 128 Center 0
WINDOW 123 0 152 Center 0
SYMATTR InstName A13
SYMATTR Value Tau=5n
SYMATTR Value2 tripdt=5n
SYMBOL Digital\\diffschmtbuf 512 -288 R180
WINDOW 0 32 104 Center 0
WINDOW 3 32 16 Center 0
WINDOW 123 32 -8 Center 0
WINDOW 39 32 -32 Center 0
SYMATTR InstName A14
SYMATTR Value Vt=-1.2 Vh=0
SYMATTR Value2 Td=50n tripdt=10n
SYMATTR SpiceLine Rout=1k Cout=300p
SYMBOL sw 544 -16 M180
WINDOW 0 32 80 Left 0
WINDOW 3 32 16 Left 0
SYMATTR InstName S3
SYMATTR Value SH
SYMBOL sw 544 16 R0
WINDOW 0 32 16 Left 0
WINDOW 3 32 80 Left 0
SYMATTR InstName S4
SYMATTR Value SL
SYMBOL sw 544 704 M180
WINDOW 0 32 80 Left 0
WINDOW 3 32 16 Left 0
SYMATTR InstName S5
SYMATTR Value SH
SYMBOL sw 544 736 R0
WINDOW 0 32 16 Left 0
WINDOW 3 32 80 Left 0
SYMATTR InstName S6
SYMATTR Value SL
SYMBOL diode -368 464 R180
WINDOW 0 32 64 Left 0
WINDOW 3 32 0 Left 0
SYMATTR InstName D5
SYMATTR Value Dd
SYMBOL cap -288 400 M0
WINDOW 0 32 0 Left 0
WINDOW 3 32 64 Left 0
WINDOW 39 32 128 Center 0
SYMATTR InstName C4
SYMATTR Value 10p
SYMATTR SpiceLine Rpar=1e6
SYMBOL cap -288 752 M0
WINDOW 0 32 0 Left 0
WINDOW 3 32 64 Left 0
WINDOW 39 32 128 Center 0
SYMATTR InstName C5
SYMATTR Value 10p
SYMATTR SpiceLine Rpar=1e6
SYMBOL cap 608 -320 R0
WINDOW 0 32 0 Left 0
WINDOW 3 32 64 Left 0
WINDOW 39 32 128 Center 0
SYMATTR InstName C6
SYMATTR Value 10p
SYMATTR SpiceLine Rpar=1e6
SYMBOL cap 608 -96 R0
WINDOW 0 32 0 Left 0
WINDOW 3 32 64 Left 0
SYMATTR InstName C7
SYMATTR Value 22p
SYMBOL cap 608 32 R0
WINDOW 0 32 0 Left 0
WINDOW 3 32 64 Left 0
WINDOW 39 32 128 Center 0
SYMATTR InstName C8
SYMATTR Value 27p
SYMATTR SpiceLine Rpar=100k
SYMBOL cap 608 624 R0
WINDOW 0 32 0 Left 0
WINDOW 3 32 64 Left 0
SYMATTR InstName C9
SYMATTR Value 22p
SYMBOL cap 608 752 R0
WINDOW 0 32 0 Left 0
WINDOW 3 32 64 Left 0
WINDOW 39 32 128 Center 0
SYMATTR InstName C10
SYMATTR Value 27p
SYMATTR SpiceLine Rpar=100k
SYMBOL diode -368 688 R180
WINDOW 0 32 64 Left 0
WINDOW 3 32 0 Left 0
SYMATTR InstName D6
SYMATTR Value Dd
SYMBOL diode -368 816 R180
WINDOW 0 32 64 Left 0
WINDOW 3 32 0 Left 0
SYMATTR InstName D7
SYMATTR Value Dd
SYMBOL diode 384 -256 R180
WINDOW 0 32 64 Left 0
WINDOW 3 32 0 Left 0
SYMATTR InstName D8
SYMATTR Value Di
SYMBOL diode 192 688 R180
WINDOW 0 32 64 Left 0
WINDOW 3 32 0 Left 0
SYMATTR InstName D9
SYMATTR Value Di
SYMBOL diode 688 -400 M180
WINDOW 0 32 64 Left 0
WINDOW 3 32 0 Left 0
SYMATTR InstName D10
SYMATTR Value Dd
SYMBOL diode 688 -256 M180
WINDOW 0 32 64 Left 0
WINDOW 3 32 0 Left 0
SYMATTR InstName D11
SYMATTR Value Dd
SYMBOL diode 688 -32 M180
WINDOW 0 32 64 Left 0
WINDOW 3 32 0 Left 0
SYMATTR InstName D12
SYMATTR Value Dd
SYMBOL diode 688 96 M180
WINDOW 0 32 64 Left 0
WINDOW 3 32 0 Left 0
SYMATTR InstName D13
SYMATTR Value Dd
SYMBOL zener 640 304 R180
WINDOW 0 0 64 Right 0
WINDOW 3 0 0 Right 0
SYMATTR InstName D14
SYMATTR Value 220V
SYMBOL zener 720 304 R180
WINDOW 0 0 64 Right 0
WINDOW 3 0 0 Right 0
SYMATTR InstName D15
SYMATTR Value 20Vb
SYMBOL zener 528 432 R180
WINDOW 0 32 64 Left 0
WINDOW 3 32 0 Left 0
SYMATTR InstName D16
SYMATTR Value 10V
SYMBOL zener 608 352 M270
WINDOW 0 36 32 VTop 0
WINDOW 3 -4 32 VBottom 0
SYMATTR InstName D17
SYMATTR Value 210V
SYMBOL zener 720 480 R180
WINDOW 0 0 64 Right 0
WINDOW 3 0 0 Right 0
SYMATTR InstName D18
SYMATTR Value 20V
SYMBOL diode 688 688 M180
WINDOW 0 32 64 Left 0
WINDOW 3 32 0 Left 0
SYMATTR InstName D19
SYMATTR Value Dd
SYMBOL diode 688 816 M180
WINDOW 0 32 64 Left 0
WINDOW 3 32 0 Left 0
SYMATTR InstName D20
SYMATTR Value Dd
TEXT 160 -576 Center 0 ;>> IRS20954 Behavioral Model by analog@ieee.org 8/2006 Rev - <<
TEXT -224 768 Left 0 !.model Di d(Ron=10)\n.model Dd d(Ron=.5 Vfwd=.5)\n.model 10V d(Ron=.5 Vfwd=.5 Vrev=10.4 Roff=12k)\n.model 20V d(Ron=.5 Vfwd=.5 Vrev=20.2 Roff=7k)\n.model 20Vb d(Ron=.5 Vfwd=.5 Vrev=20.2 Roff=22k)\n.model 210V d(Ron=.5 Vfwd=.5 Vrev=210 Roff=5e6)\n.model 220V d(Ron=.5 Vfwd=.5 Vrev=220 Roff=5e6)
TEXT 192 -480 Left 0 !.model SH sw(Vt=.5 Vh=-.5 Ron=5 Ilimit=1.0 Vser=1.2)\n.model SL sw(Vt=.5 Vh=-.5 Ron=3 Ilimit=1.2)
TEXT -264 -160 Left 0 !.model Isw sw\n+ Vt=-.5\n+ Ilimit=200u\n+ Vser=.6
TEXT -128 400 Left 0 !.model Ref sw\n+ Vt=-5.1\n+ Vh=-50m\n+ Vser=1.2\n+ Ron=10
TEXT -80 168 Right 0 ;Deadtime Generator
RECTANGLE Normal 816 928 -496 -560

The netlist it stands for:
* Fuente de alimentacion conmutada modo continuo topologia clase D(2).asc
V1 15V 0 15
V2 0 -15V 15
XM1 PWM_out N019 0 irf6665  ; pins D G S
XM2 V+ N014 PWM_out irf6665  ; pins D G S
L1 PWM_out Vf 250µ
C1 Vf 0 1µ
XU1 V_error V_triang 15V -15V Vin1 level.2 Avol=1Meg GBW=100000Meg Slew=100000Meg ilimit=25m rail=0 Vos=0 phimargin=45 en=0 enk=0 in=0 ink=0 Rin=500Meg  ; pins IN+ IN- V+ V- OUT
V4 VrefV 0 SINE(0 1 1k)
R4 N014 N013 10
R5 N019 N018 10
Rs V_salida Vf 0.1
V8 V+ 0 PULSE(50 60 1m 1u 1u 100m 100m 1)
R10 V_salida 0 1000
D1 PWM_out V+ MUR460
D2 0 PWM_out MUR460
XU4 N004 N005 15V -15V VerrorC level.2 Avol=1Meg GBW=100000Meg Slew=100000Meg ilimit=25m rail=0 Vos=0 phimargin=45 en=0 enk=0 in=0 ink=0 Rin=500Meg  ; pins IN+ IN- V+ V- OUT
R12 Vf N004 9k
R13 N004 0 1k
R14 V_salida N005 9k
R15 N005 0 1k
R16 VerrorC N005 90k
R17 N004 V_limite_C 90k
XU5 0 N001 15V -15V N012 level.2 Avol=1Meg GBW=100000Meg Slew=100000Meg ilimit=25m rail=0 Vos=0 phimargin=45 en=0 enk=0 in=0 ink=0 Rin=500Meg  ; pins IN+ IN- V+ V- OUT
XU7 0 N009 15V -15V N007 level.2 Avol=1Meg GBW=100000Meg Slew=100000Meg ilimit=25m rail=0 Vos=0 phimargin=45 en=0 enk=0 in=0 ink=0 Rin=500Meg  ; pins IN+ IN- V+ V- OUT
R8 N009 VrefV 10k
R9 N007 N009 10k
R11 N012 N001 1Meg
R19 N001 N007 10k
C6 0 V_salida 10µ
C9 N012 N001 10p
V3 V_triang 0 PULSE(-1 1 0 2.5u 2.5u 0 5u)
R6 N002 N001 90k
C7 N012 N015 100p
R20 N015 N001 100k
R21 V_salida N002 10k
C8 0 N002 1n
C10 N003 N001 1n
R23 V_salida N003 1k
V7 0 V_limite_C 2.5
Q1 N006 N008 N001 0 BC547B
Q2 -15V VerrorC N008 0 BC557B
R18 15V N008 100k
D3 P001 0 NSPW500BS
R7 15V N006 10k
Q3 N010 N006 15V 0 BC557B
R22 N010 P001 1k
C11 N006 15V 100n
D4 N011 VerrorC 1N4148
D5 N011 N001 1N750
XX1 15V Vin1 N021 0 N023 N025 N026 0 N018 N024 PWM_out N013 N020 N016 irs20954 params: IRS20954
C2 N020 PWM_out 22n
Ct1 N021 0 10p
C3 N024 0 30n
D6 N024 N022 MUR460
V5 N024 0 15
RD1 N020 N022 10
R1 N016 PWM_out 4.6k
R2 N017 N016 5.4k
R3 N020 N017 10k
R24 N025 0 4k
R25 N023 N025 6k
R26 N024 N026 3.3k
R27 N026 0 8.2k
V6 V_error 0 PULSE(-0.5 0.5 0 1m 1m 0 2m)

* block symbol definitions
.subckt irs20954 Vdd In CSD Vss Vref OCset DT Com Lo Vcc Vs Ho Vb CsH
D1 CSD Vdd Dd
D2 Vss CSD Dd
C1 CSD Vss 10p Rpar=1e6
I1 Vdd CSD TBL(1.2 0 1.3 100u)
S1 Vss CSD 0 7 Isw
R1 Vdd 1 30k
R2 2 1 40k
R3 2 Vss 30k
A1 CSD 1 0 0 0 0 6 0 SCHMITT Vt=0 Vh=0 Td=300n tripdt=10n
A2 2 CSD 0 0 0 0 8 0 SCHMITT Vt=0 Vh=0 Td=200n tripdt=10n
D3 In Vdd Dd
D4 Vss In Dd
C2 In Vss 10p
A3 In Vss 0 0 0 4 3 0 SCHMITT Vt=1.9 Vh=0.4 Trise=50n Tfall=2n tripdt=2n
A4 3 5 0 0 0 0 10 0 SCHMITT Vt=0 Vh=0 Td=80n tripdt=5n
A5 4 5 0 0 0 0 11 0 SCHMITT Vt=0 Vh=0 Td=80n tripdt=5n
B1 0 5 I=table(V(DT,Com)/V(Vcc,Com),359m,9m,360m, 7m,569m,7m,570m,5m,889m,5m,890m,3m)
C3 5 0 1n Rpar=100
S2 Vref Vcc Com Vref Ref
A6 OCset Vs 0 0 0 0 12 0 SCHMITT Vt=-0 Vh=0 Td=50n tripdt=10n Rout=1k Cout=200p
A7 8 9 0 0 0 0 7 0 SRFLOP Td=100n tripdt=10n
A8 12 16 15 14 13 9 0 0 AND Ref=.37 Td=500n tripdt=10n
A9 0 10 6 7 14 18 17 0 AND Tau=5n tripdt=5n
A10 Vb Vs 0 0 0 0 14 0 SCHMITT Vt=8.4 Vh=.1 Td=50n tripdt=10n
A11 Vdd Vss 0 0 0 0 15 0 SCHMITT Vt=8.45 Vh=.25 Td=50n tripdt=10n
A12 Vcc Com 0 0 0 0 16 0 SCHMITT Vt=8.8 Vh=.1 Td=50n tripdt=10n
A13 16 6 7 11 0 20 19 0 AND Tau=5n tripdt=5n
A14 Vs CsH 0 0 0 0 13 0 SCHMITT Vt=-1.2 Vh=0 Td=50n tripdt=10n Rout=1k Cout=300p
S3 Ho Vb 17 0 SH
S4 Ho Vs 18 0 SL
S5 Lo Vcc 19 0 SH
S6 Lo Com 20 0 SL
D5 Com Vref Dd
C4 Vref Com 10p Rpar=1e6
C5 OCset Com 10p Rpar=1e6
C6 CsH Vs 10p Rpar=1e6
C7 Vb Ho 22p
C8 Ho Vs 27p Rpar=100k
C9 Vcc Lo 22p
C10 Lo Com 27p Rpar=100k
D6 OCset Vcc Dd
D7 Com OCset Dd
D8 18 13 Di
D9 20 12 Di
D10 CsH Vb Dd
D11 Vs CsH Dd
D12 Ho Vb Dd
D13 Vs Ho Dd
D14 Com Vb 220V
D15 Vs Vb 20Vb
D16 Vss Vdd 10V
D17 Com Vdd 210V
D18 Com Vcc 20V
D19 Lo Vcc Dd
D20 Com Lo Dd
* >> IRS20954 Behavioral Model by analog@ieee.org 8/2006 Rev - <<
.model Di d(Ron=10)
.model Dd d(Ron=.5 Vfwd=.5)
.model 10V d(Ron=.5 Vfwd=.5 Vrev=10.4 Roff=12k)
.model 20V d(Ron=.5 Vfwd=.5 Vrev=20.2 Roff=7k)
.model 20Vb d(Ron=.5 Vfwd=.5 Vrev=20.2 Roff=22k)
.model 210V d(Ron=.5 Vfwd=.5 Vrev=210 Roff=5e6)
.model 220V d(Ron=.5 Vfwd=.5 Vrev=220 Roff=5e6)
.model SH sw(Vt=.5 Vh=-.5 Ron=5 Ilimit=1.0 Vser=1.2)
.model SL sw(Vt=.5 Vh=-.5 Ron=3 Ilimit=1.2)
.model Isw sw
+ Vt=-.5
+ Ilimit=200u
+ Vser=.6
.model Ref sw
+ Vt=-5.1
+ Vh=-50m
+ Vser=1.2
+ Ron=10
* Deadtime Generator
.ends irs20954

.model D D
.lib standard.dio
.model NPN NPN
.model PNP PNP
.lib standard.bjt
.model SW SW(Ron=0.001 Roff=100Meg Vt=0.5 Vh=0.25)
.tran 0 30m 0 1u uic
.include irf6665.spi
.model SWC SW(Ron=0.1 Roff=100Meg Vt=0.5 Vh=0.25)
.lib UniversalOpamps2.sub
.backanno
.end